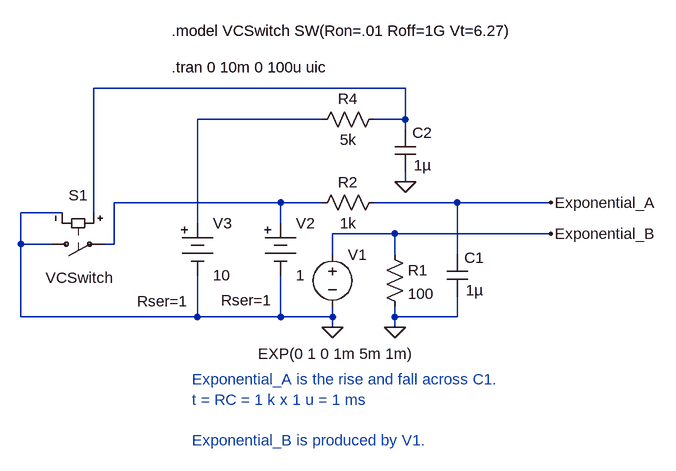
[diagram p0: schematic Exponential.asc]
Exponential.asc, the LTspice schematic file:
Version 4
SHEET 1 880 680
WIRE 160 -96 -320 -96
WIRE 32 -48 -160 -48
WIRE 160 -48 160 -96
WIRE 160 -48 112 -48
WIRE 160 -32 160 -48
WIRE 160 48 160 32
WIRE -32 80 -288 80
WIRE 32 80 -32 80
WIRE 240 80 112 80
WIRE 384 80 240 80
WIRE -368 96 -432 96
WIRE -320 96 -320 -96
WIRE -160 112 -160 -48
WIRE -32 112 -32 80
WIRE 144 128 48 128
WIRE 384 128 144 128
WIRE -432 144 -432 96
WIRE -384 144 -432 144
WIRE -288 144 -288 80
WIRE -288 144 -304 144
WIRE 48 160 48 128
WIRE 144 160 144 128
WIRE 240 160 240 80
WIRE -432 256 -432 144
WIRE -160 256 -160 192
WIRE -160 256 -432 256
WIRE -32 256 -32 192
WIRE -32 256 -160 256
WIRE 48 256 48 240
WIRE 48 256 -32 256
WIRE 144 256 144 240
WIRE 240 256 240 224
WIRE 240 256 144 256
WIRE 48 272 48 256
WIRE 144 272 144 256
FLAG 48 272 0
FLAG 144 272 0
FLAG 160 48 0
FLAG 384 80 Exponential_A
FLAG 384 128 Exponential_B
SYMBOL voltage 48 144 R0
WINDOW 3 -115 169 Left 0
WINDOW 123 0 0 Left 0
WINDOW 39 0 0 Left 0
SYMATTR Value EXP(0 1 0 1m 5m 1m)
SYMATTR InstName V1
SYMBOL res 128 144 R0
SYMATTR InstName R1
SYMATTR Value 100
SYMBOL Misc\\battery -32 96 R0
WINDOW 123 0 0 Left 0
WINDOW 39 -92 134 Left 0
SYMATTR SpiceLine Rser=1
SYMATTR InstName V2
SYMATTR Value 1
SYMBOL res 128 64 R90
WINDOW 0 0 56 VBottom 0
WINDOW 3 32 56 VTop 0
SYMATTR InstName R2
SYMATTR Value 1k
SYMBOL sw -400 144 M90
WINDOW 0 -75 71 VLeft 0
WINDOW 3 52 110 VLeft 0
SYMATTR InstName S1
SYMATTR Value VCSwitch
SYMBOL cap 144 -32 R0
WINDOW 0 27 5 Left 0
WINDOW 3 29 55 Left 0
SYMATTR InstName C2
SYMATTR Value 1µ
SYMBOL res 128 -64 R90
WINDOW 0 0 56 VBottom 0
WINDOW 3 32 56 VTop 0
SYMATTR InstName R4
SYMATTR Value 5k
SYMBOL Misc\\battery -160 96 R0
WINDOW 123 0 0 Left 0
WINDOW 39 -93 136 Left 0
SYMATTR SpiceLine Rser=1
SYMATTR InstName V3
SYMATTR Value 10
SYMBOL cap 224 160 R0
WINDOW 0 27 5 Left 0
WINDOW 3 29 55 Left 0
SYMATTR InstName C1
SYMATTR Value 1µ
TEXT -200 -128 Left 0 !.tran 0 10m 0 100u uic
TEXT -200 -184 Left 0 !.model VCSwitch SW(Ron=.01 Roff=1G Vt=6.27)
TEXT -168 352 Left 0 ;Exponential_A is the rise and fall across C1.\nt = RC = 1 k x 1 u = 1 ms\n \nExponential_B is produced by V1.

The netlist it stands for:
* Exponential.asc
V1 Exponential_B 0 EXP(0 1 0 1m 5m 1m)
R1 Exponential_B 0 100
V2 N003 0 1 Rser=1
R2 Exponential_A N003 1k
S1 0 N003 N001 0 VCSwitch
C2 N001 0 1µ
R4 N001 N002 5k
V3 N002 0 10 Rser=1
C1 Exponential_A 0 1µ
.tran 0 10m 0 100u uic
.model VCSwitch SW(Ron=.01 Roff=1G Vt=6.27)
* Exponential_A is the rise and fall across C1.
* t = RC = 1 k x 1 u = 1 ms
* Exponential_B is produced by V1.
.backanno
.end